# EAGLE design avrboard (EAGLE 4.16)
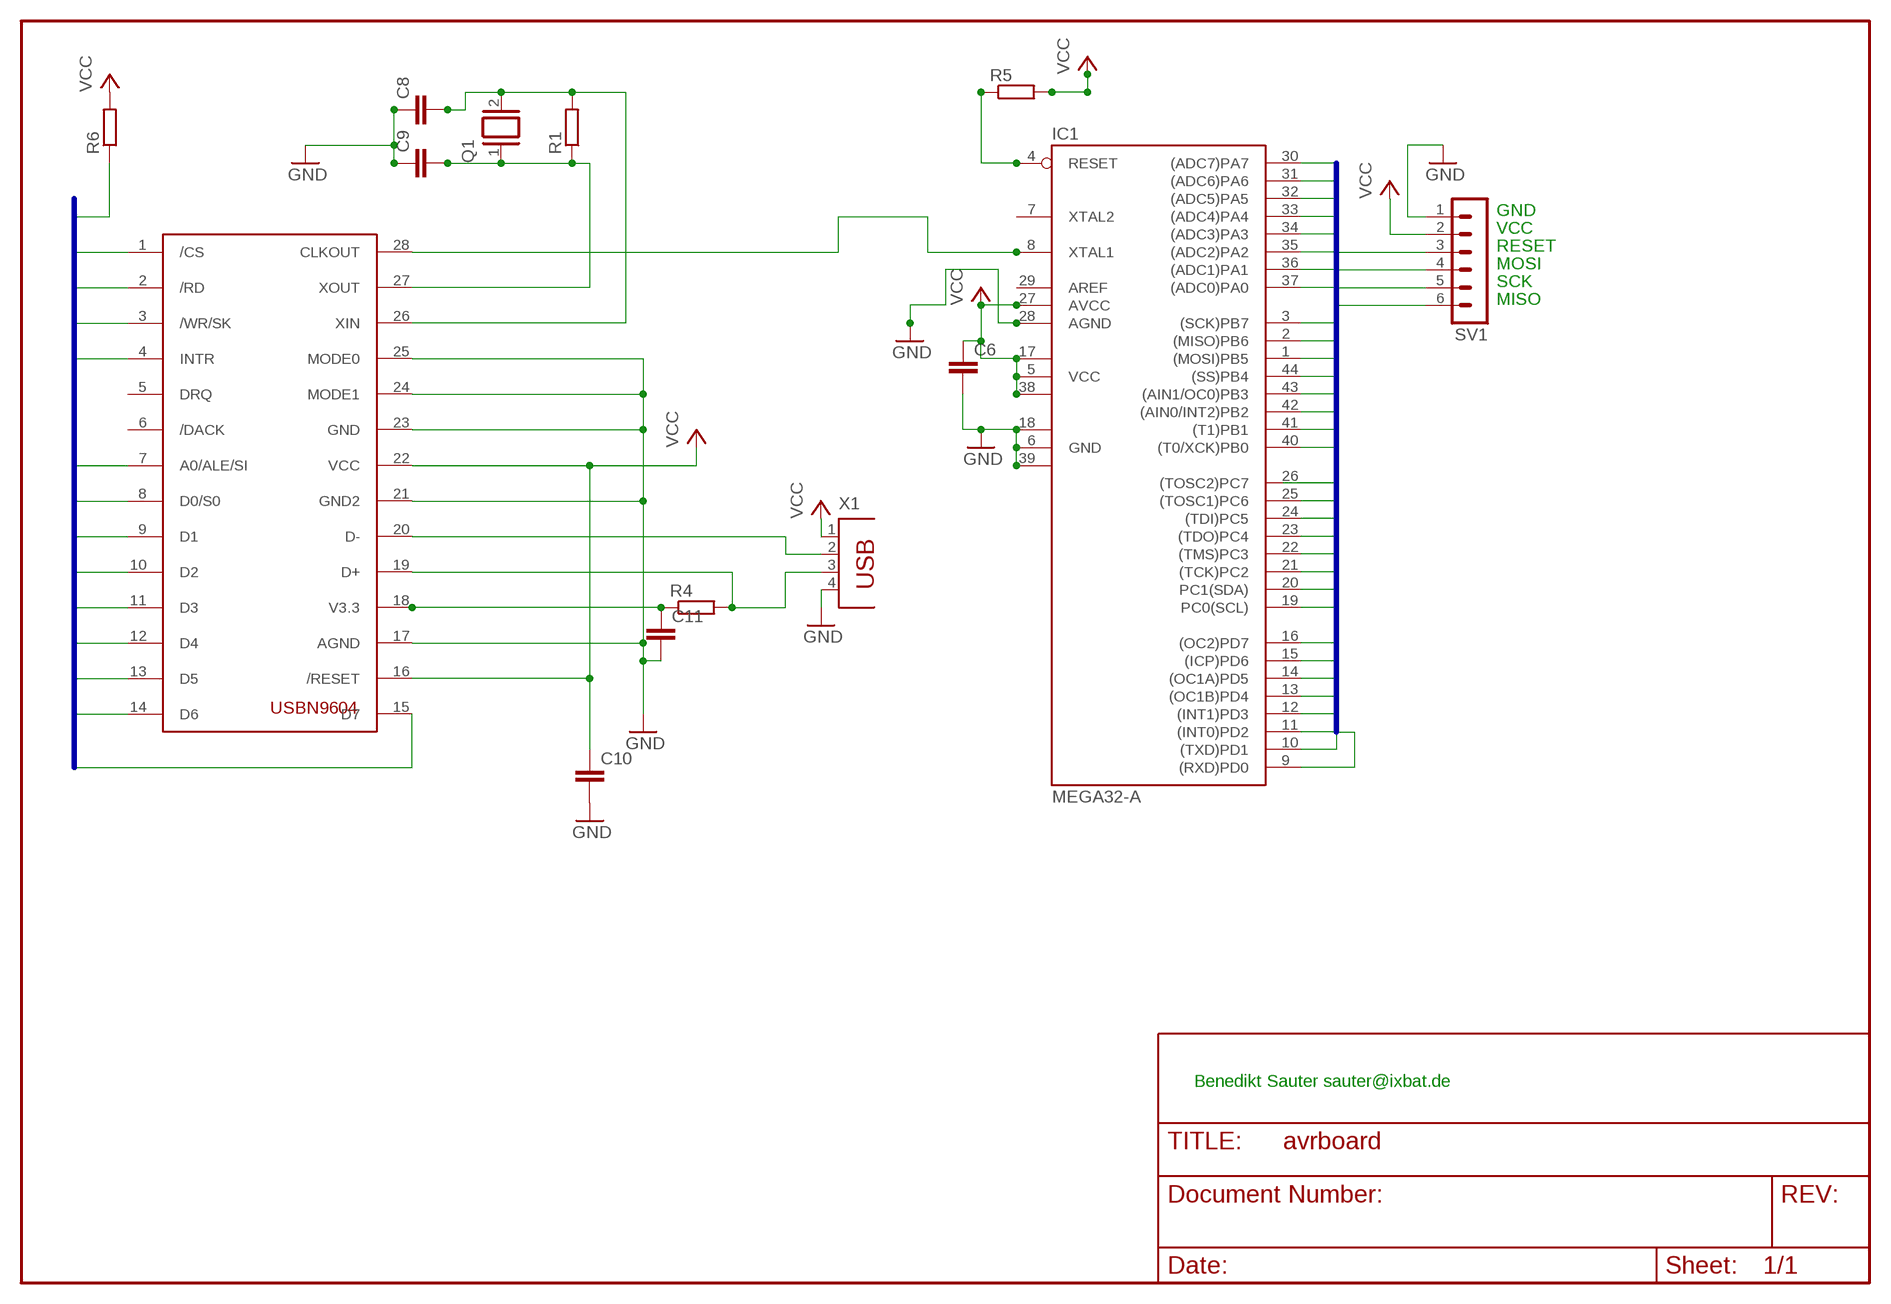
[diagram p0: schematic, sheet 1]

## Parts
C6  C-EU025-024X044  [C025-024X044]
C8  C-EU025-024X044  [C025-024X044]
C9  C-EU025-024X044  [C025-024X044]
C10  C-EU025-024X044  [C025-024X044]
C11  C-EU025-024X044  [C025-024X044]
IC1  MEGA32-A  [TQFP44]
M1  USBN9604  [SO28-3]
Q1  XTAL/S  [QS]
R1  R-EU_0204/7  [0204/7]
R4  R-EU_0204/5  [0204/5]
R5  R-EU_0204/2V  [0204V]
R6  R-EU_0204/7  [0204/7]
SV1  MA06-1  [MA06-1]
X1  PN61729  [PN61729]

## Nets
GND: C6.2 C8.1 C9.1 C10.2 C11.2 IC1.6(GND) IC1.18(GND1) IC1.28(AGND) IC1.39(GND2) M1.17(AGND) M1.21(GND2) M1.23(GND) M1.24(MODE1) M1.25(MODE0) SV1.1 X1.4
N$7: C11.1 M1.18(V3.3) R4.1
N$8: C8.2 M1.26(XIN) Q1.2 R1.2
N$10: IC1.8(XTAL1) M1.28(CLKOUT)
N$11: C9.2 M1.27(XOUT) Q1.1 R1.1
N$12: M1.19(D+) R4.2 X1.3
N$15: M1.20(D-) X1.2
PA0: IC1.37((ADC0)PA0)
PA1: IC1.36((ADC1)PA1)
PA2: IC1.35((ADC2)PA2)
PA3: IC1.34((ADC3)PA3)
PA4: IC1.33((ADC4)PA4)
PA5: IC1.32((ADC5)PA5)
PA6: IC1.31((ADC6)PA6)
PA7: IC1.30((ADC7)PA7)
PB0: IC1.40((T0/XCK)PB0) SV1.3
PB1: IC1.41((T1)PB1)
PB2: IC1.42((AIN0/INT2)PB2)
PB3: IC1.43((AIN1/OC0)PB3)
PB4: IC1.44((SS)PB4)
PB5: IC1.1((MOSI)PB5) SV1.4
PB6: IC1.2((MISO)PB6) SV1.6
PB7: IC1.3((SCK)PB7) SV1.5
PC0: IC1.19(PC0(SCL)) M1.8(D0/S0)
PC1: IC1.20(PC1(SDA)) M1.9(D1)
PC2: IC1.21((TCK)PC2) M1.10(D2)
PC3: IC1.22((TMS)PC3) M1.11(D3)
PC4: IC1.23((TDO)PC4) M1.12(D4)
PC5: IC1.24((TDI)PC5) M1.13(D5)
PC6: IC1.25((TOSC1)PC6) M1.14(D6)
PC7: M1.15(D7)
PD0: IC1.9((RXD)PD0)
PD1: IC1.10((TXD)PD1)
PD2: IC1.11((INT0)PD2) M1.4(INTR) R6.1
PD3: IC1.12((INT1)PD3) M1.1(/CS)
PD4: IC1.13((OC1B)PD4) M1.2(/RD)
PD5: IC1.14((OC1A)PD5) M1.3(/WR/SK)
PD6: IC1.15((ICP)PD6) M1.7(A0/ALE/SI)
PD7: IC1.16((OC2)PD7)
RESET: IC1.4(RESET) R5.1
VCC: C6.1 C10.1 IC1.5(VCC) IC1.17(VCC1) IC1.27(AVCC) IC1.38(VCC2) M1.16(/RESET) M1.22(VCC) R5.2 R6.2 SV1.2 X1.1
Unconnected: IC1.7(XTAL2) IC1.26((TOSC2)PC7) M1.5(DRQ) M1.6(/DACK)

## Buses
PD0,PD1,PD2,PD3,PD4,PD5,PD6,PD7,PC0,PC1,PC2,PC3,PC4,PC5,PC6,PC7,PB0,PB1,PB2,PB3,PB4,PB5,PB6,PB7,PA0,PA1,PA2,PA3,PA4,PA5,PA6,PA7

## Notes on the sheet
- GND
- VCC
- RESET
- MOSI
- SCK
- MISO
- Benedikt Sauter sauter@ixbat.de

## Power pins joined to a net without a drawn wire
AREF: IC1.29(AREF)

## Library data of the parts
C6 C8-C11 = rcl:C-EU: CAPACITOR, European symbol
IC1 = avr:MEGA32: MICROCONTROLLER 32 Kbytes FLASH 2 Kbytes SRAM 1 Kbytes EEPROM USART 8-channel 10 bit ADC
M1 = bene:USBN9604
Q1 = special:XTAL/S: CRYSTAL
R1 R4-R6 = rcl:R-EU_: RESISTOR, European symbol
SV1 = con-lstb:MA06-1: PIN HEADER
X1 = con-berg:PN61729: BERG USB connector

## Board
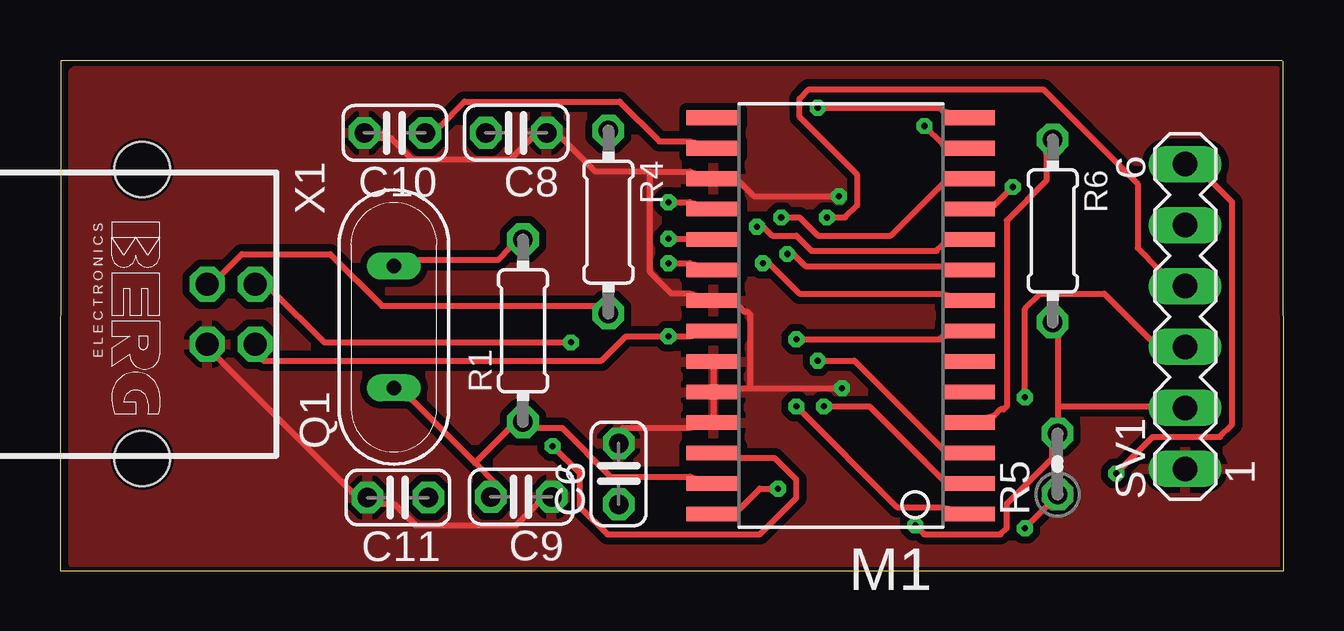
[diagram p1: board, top side]
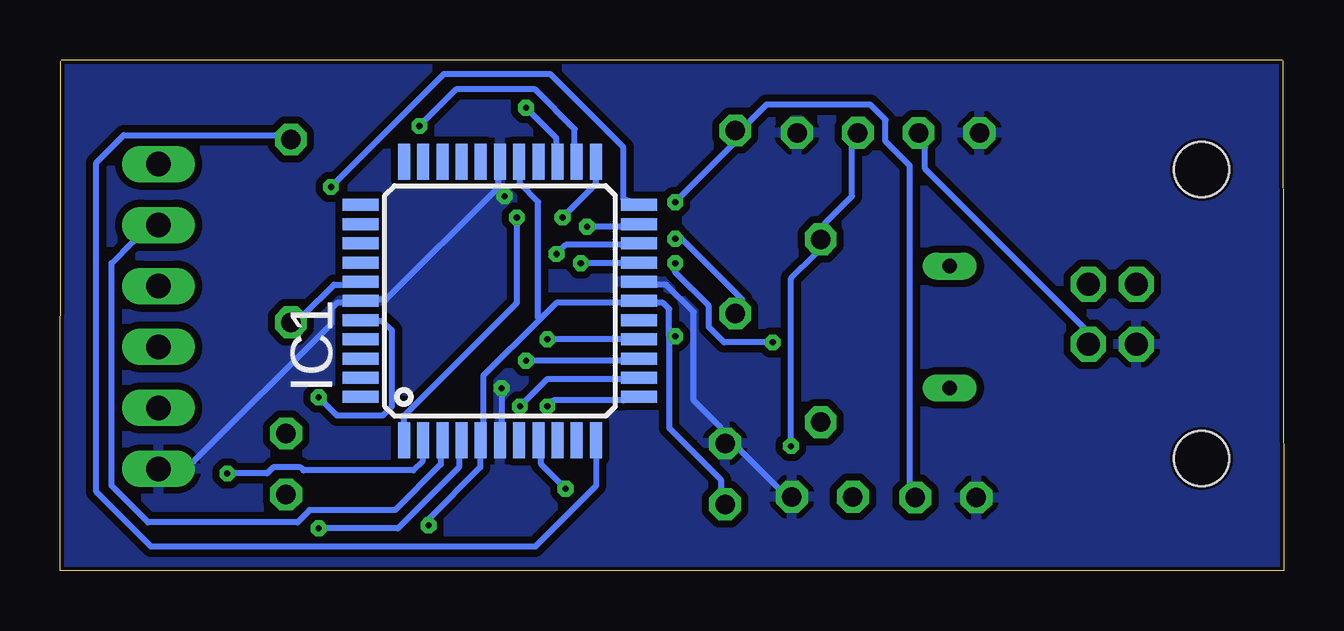
[diagram p2: board, bottom side, seen from below]

Size 51.01 x 21.29 mm. Coordinates in mm from the lower left corner, seen from the top.
Outline: 50.98,21.23 51.01,0 0,0.01 0.03,21.25
Outline: 0.05,21.29 50.96,21.28
Copper layers (1*16): Top 0.5mm / dielectric 3mm / Bottom 0.5mm
Design rules "default": minimum track width 10mil, minimum drill 10mil, track to track 12mil, track to pad 12mil, pad to pad 12mil, via to via 12mil, smd to smd 12mil, copper to edge 6mil, drill to drill 6mil, minimum pad ring 10mil, minimum via ring 8mil, stop-mask expansion 4mil, vias tented up to drill 0mil, thermal gap 10mil

### Footprints (pad centres in the part's own frame; a part is rotated, then mirrored left to right if it is on the bottom)
C025-024X044 = drill 0.813 octagon: 1 -1.27,0; 2 1.27,0
TQFP44 = smd 1.5 x 0.5: 1 -5.8,4; 2 -5.8,3.2; 3 -5.8,2.4; 4 -5.8,1.6; 5 -5.8,0.8; 6 -5.8,0; 7 -5.8,-0.8; 8 -5.8,-1.6; 9 -5.8,-2.4; 10 -5.8,-3.2; 11 -5.8,-4; 23 5.8,-4; 24 5.8,-3.2; 25 5.8,-2.4; 26 5.8,-1.6; 27 5.8,-0.8; 28 5.8,0; 29 5.8,0.8; 30 5.8,1.6; 31 5.8,2.4; 32 5.8,3.2; 33 5.8,4 | smd 0.5 x 1.5: 12 -4,-5.8; 13 -3.2,-5.8; 14 -2.4,-5.8; 15 -1.6,-5.8; 16 -0.8,-5.8; 17 0,-5.8; 18 0.8,-5.8; 19 1.6,-5.8; 20 2.4,-5.8; 21 3.2,-5.8; 22 4,-5.8; 34 4,5.8; 35 3.2,5.8; 36 2.4,5.8; 37 1.6,5.8; 38 0.8,5.8; 39 0,5.8; 40 -0.8,5.8; 41 -1.6,5.8; 42 -2.4,5.8; 43 -3.2,5.8; 44 -4,5.8
SO28-3 = smd 0.61 x 2.21: 1 -8.255,-5.315; 2 -6.985,-5.315; 3 -5.715,-5.315; 4 -4.445,-5.315; 5 -3.175,-5.315; 6 -1.905,-5.315; 7 -0.635,-5.315; 8 0.635,-5.315; 9 1.905,-5.315; 10 3.175,-5.315; 11 4.445,-5.315; 12 5.715,-5.315; 13 6.985,-5.315; 14 8.255,-5.315; 15 8.255,5.315; 16 6.985,5.315; 17 5.715,5.315; 18 4.445,5.315; 19 3.175,5.315; 20 1.905,5.315; 21 0.635,5.315; 22 -0.635,5.315; 23 -1.905,5.315; 24 -3.175,5.315; 25 -4.445,5.315; 26 -5.715,5.315; 27 -6.985,5.315; 28 -8.255,5.315
QS = drill 0.61 long: 1 -2.54,0; 2 2.54,0
0204/7 = drill 0.813 octagon: 1 -3.81,0; 2 3.81,0
0204V = drill 0.813 octagon: 1 -1.27,0; 2 1.27,0
MA06-1 = drill 1.016 long: 1 -6.35,0; 2 -3.81,0; 3 -1.27,0; 4 1.27,0; 5 3.81,0; 6 6.35,0
PN61729 = drill 0.95 octagon: 1 1.25,4.71; 2 -1.25,4.71; 3 -1.25,2.71; 4 1.25,2.71 | hole 2.3: -6.02,0; 6.02,0

### Placement (x,y rotation side)
C6  23.29,4.04 90 top
C8  19.02,18.25 180 top
C9  19.23,3.09 180 top
C10  13.95,18.25 180 top
C11  14.08,3.06 180 top
IC1  32.67,11.25 90 bottom
M1  32.54,10.63 90 top
Q1  13.92,10.16 90 top
R1  19.3,10.01 90 top
R4  [0204/7]  22.86,14.53 270 top
R5  41.58,4.45 90 top
R6  41.38,14.17 270 top
SV1  46.9,10.6 90 top
X1  3.43,10.7 270 top

### Tracks (layer width: path | path; a pad name or v marks a point on that pad's centre or on a via)
GND  (via drill 0.25)
  Top 0.254: 24.6,16.63 22.31,16.63 20.92,18.03 C8.1 19.65,18.03 18.76,17.14 14.69,17.14 13.81,18.03 13.3,18.03 C10.2 | 24.6,16.63 26.25,16.63 M1.17 28.28,16.25 28.92,15.61 v32.47,15.61 | X1.4 6.57,8.88 12.15,3.3 C11.2 13.42,2.79 13.93,2.79 14.82,1.9 19.01,1.9 19.9,2.79 C9.1 | 28.79,7.61 28.28,7.61 M1.24 | 28.79,7.61 v32.6,7.61 | M1.24 27.27,7.23 27.27,6.47 M1.25 26.25,5.96 23.46,5.96 C6.2 | M1.23 27.27,8.5 27.27,7.74 M1.24 | 28.79,7.61 28.79,10.66 28.66,10.79 28.54,10.79 28.28,11.04 M1.21 26.25,11.55 25.49,11.55 24.6,12.44 24.6,16.63
  Bottom 0.254: 32.79,15.93 37.43,11.3 37.81,11.3 IC1.39 39.2,11.17 39.46,11.17 39.71,10.92 39.71,10.28 45.43,4.57 SV1.1 | 32.79,15.93 32.73,16 32.73,16.38 IC1.28 | v32.6,7.61 32.6,6.09 IC1.6 | IC1.18 26.12,11.93 25.74,11.93 24.6,10.79 24.6,7.11 23.46,5.96 C6.2 22.7,5.07 21.04,3.42 C9.1 | v32.47,15.61 32.79,15.93
  pour Bottom: 0.17,21.25 50.93,21.25 50.93,-0.03 0.22,-0.03 0.22,21.2
  pour Top: 0.62,20.84 50.71,20.84 50.71,0.31 0.57,0.31 0.57,20.79
N$7  (via drill 0.25)
  Top 0.254: v25.36,15.36 26.25,15.36 M1.18
  Bottom 0.254: v25.36,15.36 22.95,17.77 R4.1 22.31,18.66 21.55,19.43 17.23,19.43 16.6,18.79 16.6,17.9 15.58,16.89 15.58,3.68 C11.1
N$8  (via drill 0.25)
  Top 0.254: v20.54,5.2 21.68,4.06 21.68,2.66 22.82,1.52 29.17,1.52 30.7,3.04 30.7,3.8 29.81,4.69 28.28,4.69 M1.26 | Q1.2 14.95,12.95 18.25,12.95 18.76,13.46 R1.2
  Bottom 0.254: v20.54,5.2 20.54,12.19 19.52,13.2 R1.2 19.14,14.47 18,15.61 18,17.65 C8.2
N$10  (via drill 0.25)
  Top 0.254: v29.93,3.42 29.17,3.42 28.28,2.53 M1.28
  Bottom 0.254: v29.93,3.42 30.95,4.44 30.95,4.82 IC1.8
N$11
  Top 0.254: 17.3,4.5 18.12,3.68 C9.2 | 17.3,4.5 14.69,7.11 Q1.1 | M1.27 26.25,3.93 22.95,3.93 20.92,5.96 19.9,5.96 R1.1 18.76,5.96 17.3,4.5
N$12  (via drill 0.25)
  Top 0.254: v25.36,13.84 26.25,13.84 M1.19 | X1.3 6.69,12.31 7.58,13.2 11.27,13.2 13.42,11.04 22.31,11.04 R4.2
  Bottom 0.254: v25.36,13.84 25.11,13.84 22.57,11.3 R4.2
N$15  (via drill 0.25)
  Top 0.254: v25.36,12.82 26.25,12.82 M1.20 | v21.3,9.52 11.01,9.52 8.85,11.68 X1.2
  Bottom 0.254: v25.36,12.82 25.36,12.44 23.96,11.04 23.96,10.15 23.33,9.52 v21.3,9.52
PB0  (via drill 0.25)
  Top 0.254: v40.22,7.23 40.22,10.92 40.86,11.55 43.52,11.55 45.43,9.65 SV1.3
  Bottom 0.254: v40.22,7.23 39.46,6.47 37.55,6.47 37.17,6.85 37.17,10.03 37.55,10.41 37.81,10.41 IC1.40
PB5  (via drill 0.25)
  Top 0.254: v31.97,14.73 32.73,14.73 33.24,15.23 33.24,16.5 30.82,18.92 30.82,19.68 31.2,20.06 40.98,20.06 44.92,16.12 44.92,13.46 45.81,12.57 SV1.4
  Bottom 0.254: v31.97,14.73 31.97,11.17 36.66,6.47 36.66,6.09 IC1.1
PB6  (via drill 0.25)
  Top 0.254: v44.03,4.06 45.55,5.58 48.35,5.58 48.86,6.09 48.86,15.36 47.97,16.25 SV1.6
  Bottom 0.254: v44.03,4.06 42.38,4.06 42.13,4.31 40.98,4.31 40.86,4.18 36.28,4.18 35.9,4.57 35.9,4.82 IC1.2
PB7
  Bottom 0.254: IC1.3 35.14,4.82 35.14,4.44 37.05,2.53 40.6,2.53 41.11,2.03 47.33,2.03 48.86,3.55 48.86,12.82 47.97,13.71 SV1.5
PC0  (via drill 0.25)
  Top 0.254: v29.3,12.82 29.55,12.82 30.82,11.55 36.79,11.55 M1.8
  Bottom 0.254: v29.3,12.82 27.52,12.82 IC1.19
PC1  (via drill 0.25)
  Top 0.254: v30.31,13.2 30.57,13.2 31.08,12.69 36.79,12.69 M1.9
  Bottom 0.254: v30.31,13.2 29.93,13.58 27.52,13.58 IC1.20
PC2  (via drill 0.25)
  Top 0.254: v29.04,14.34 29.3,14.34 29.68,13.96 30.7,13.96 31.33,13.33 36.54,13.33 36.79,13.58 M1.10
  Bottom 0.254: v29.04,14.34 27.52,14.34 IC1.21
PC3  (via drill 0.25)
  Top 0.254: v39.71,16 38.95,15.23 M1.11
  Bottom 0.254: v39.71,16 35.01,20.7 30.57,20.7 27.52,17.65 27.52,15.49 IC1.22
PC4  (via drill 0.25)
  Top 0.254: v30.06,14.73 30.82,14.73 31.58,13.96 34.63,13.96 36.79,16.12 M1.12
  Bottom 0.254: v30.06,14.73 28.66,16.12 28.66,16.38 IC1.23
PC5  (via drill 0.25)
  Top 0.254: v36.03,18.54 36.79,17.77 M1.13
  Bottom 0.254: v36.03,18.54 34.51,20.06 31.2,20.06 29.55,18.41 29.55,17.77 IC1.24
PC6  (via drill 0.25)
  Top 0.254: v31.58,19.3 36.66,19.3 36.79,19.17 M1.14
  Bottom 0.254: v31.58,19.3 30.31,18.03 30.31,17.77 IC1.25
PD2
  Top 0.254: M1.4 38.95,6.47 39.2,6.72 39.33,6.72 39.46,6.85 39.46,14.6 41.11,16.25 41.11,17.39 R6.1
  Bottom 0.254: IC1.11 28.66,4.82 28.66,3.55 31.2,1.01 47.21,1.01 49.49,3.3 49.49,17.01 48.35,18.16 42,18.16 R6.1
PD3  (via drill 0.25)
  Top 0.254: v30.7,6.85 34.89,2.66 36.79,2.66 M1.1
  Bottom 0.254: v30.7,6.85 30.44,7.11 27.52,7.11 IC1.12
PD4  (via drill 0.25)
  Top 0.254: v31.84,6.85 33.74,6.85 36.79,3.8 M1.2
  Bottom 0.254: v31.84,6.85 30.7,8 27.52,8 IC1.13
PD5  (via drill 0.25)
  Top 0.254: v31.58,8.76 33.11,8.76 36.79,5.07 M1.3
  Bottom 0.254: v31.58,8.76 27.52,8.76 IC1.14
PD6  (via drill 0.25)
  Top 0.254: v30.7,9.65 36.66,9.65 36.79,9.77 M1.7
  Bottom 0.254: v30.7,9.65 27.52,9.65 IC1.15
RESET  (via drill 0.25)
  Top 0.254: v40.22,1.77 41.24,2.79 R5.1
  Bottom 0.254: v40.22,1.77 36.92,1.77 34.38,4.31 34.38,4.82 IC1.4
VCC  (via drill 0.25)
  Top 0.254: M1.16 26.25,17.9 24.98,17.9 23.33,19.55 16.85,19.55 15.84,18.54 C10.1 | M1.22 26.25,9.77 v25.36,9.77 23.58,9.77 22.57,8.76 8.47,8.76 X1.1 | 41.62,6.85 41.62,9.77 R6.2 | 41.62,6.85 41.62,6.34 R5.2 41.36,5.07 41.36,4.69 39.46,2.79 39.46,1.77 39.2,1.52 36.03,1.52 v35.65,1.9 | 41.62,6.85 45.43,6.85 SV1.2
  Bottom 0.254: C10.1 14.95,17.65 14.95,16.76 8.34,10.15 X1.1 | IC1.38 39.2,11.93 39.59,11.93 40.86,10.66 R6.2 | 31.01,10.47 33.36,8.12 33.36,6.09 IC1.5 33.49,4.82 33.49,4.31 35.65,2.15 v35.65,1.9 | 31.01,10.47 30.31,11.17 27.52,11.17 IC1.17 26.12,11.17 25.87,11.17 25.62,10.92 25.62,9.77 | IC1.27 31.84,16.38 31.84,16.12 31.08,15.36 31.08,10.54 31.01,10.47 | 25.62,9.77 25.62,5.96 23.46,3.8 23.46,3.42 C6.1 | v25.36,9.77 25.62,9.77